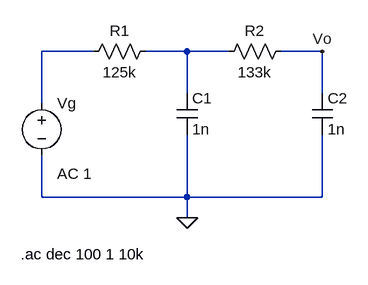
[diagram p0: schematic problem4.asc]
problem4.asc, the LTspice schematic file:
Version 4.1
SHEET 1 880 680
WIRE 112 48 32 48
WIRE 256 48 192 48
WIRE 320 48 256 48
WIRE 464 48 400 48
WIRE 256 112 256 48
WIRE 464 112 464 48
WIRE 32 128 32 48
WIRE 32 272 32 208
WIRE 256 272 256 176
WIRE 256 272 32 272
WIRE 464 272 464 176
WIRE 464 272 256 272
WIRE 256 304 256 272
FLAG 256 304 0
FLAG 464 48 Vo
SYMBOL res 208 32 R90
WINDOW 0 0 56 VBottom 2
WINDOW 3 32 56 VTop 2
SYMATTR InstName R1
SYMATTR Value 125k
SYMBOL res 416 32 R90
WINDOW 0 0 56 VBottom 2
WINDOW 3 32 56 VTop 2
SYMATTR InstName R2
SYMATTR Value 133k
SYMBOL cap 240 112 R0
SYMATTR InstName C1
SYMATTR Value 1n
SYMBOL cap 448 112 R0
SYMATTR InstName C2
SYMATTR Value 1n
SYMBOL voltage 32 112 R0
WINDOW 123 24 124 Left 2
WINDOW 39 0 0 Left 0
SYMATTR InstName Vg
SYMATTR Value ""
SYMATTR Value2 AC 1
TEXT 0 360 Left 2 !.ac dec 100 1 10k

The netlist it stands for:
* problem4.asc
R1 N002 N001 125k
R2 Vo N002 133k
C1 N002 0 1n
C2 Vo 0 1n
Vg N001 0 AC 1
.ac dec 100 1 10k
.backanno
.end